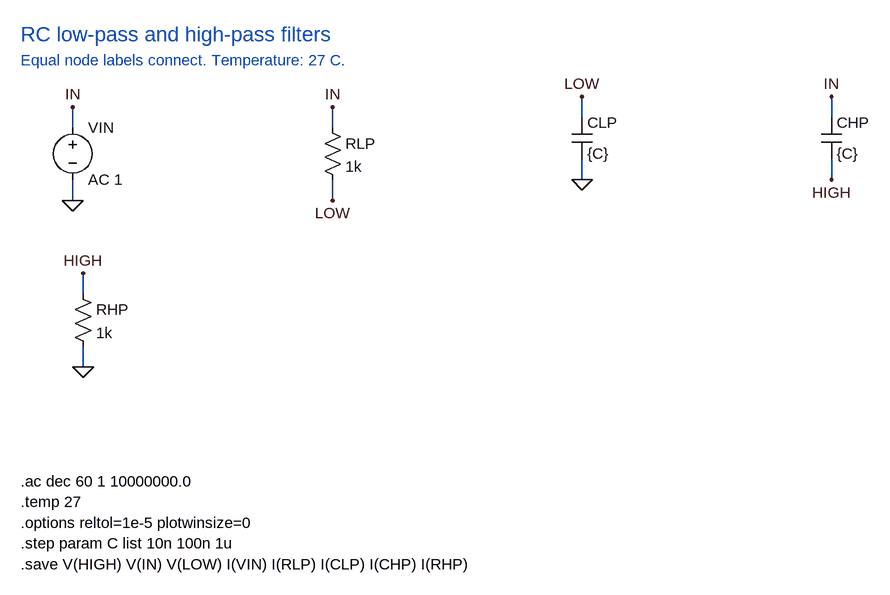
[diagram p0: schematic rc-filter-pair.asc]
rc-filter-pair.asc, the LTspice schematic file:
Version 4
SHEET 1 1740 1000
WIRE 144 176 144 144
WIRE 144 256 144 288
WIRE 544 176 544 144
WIRE 544 256 544 288
WIRE 928 160 928 128
WIRE 928 224 928 256
WIRE 1312 160 1312 128
WIRE 1312 224 1312 256
WIRE 160 432 160 400
WIRE 160 512 160 544
FLAG 144 144 IN
FLAG 144 288 0
FLAG 544 144 IN
FLAG 544 288 LOW
FLAG 928 128 LOW
FLAG 928 256 0
FLAG 1312 128 IN
FLAG 1312 256 HIGH
FLAG 160 400 HIGH
FLAG 160 544 0
SYMBOL voltage 144 160 R0
SYMATTR InstName VIN
SYMATTR Value AC 1
SYMBOL res 528 160 R0
SYMATTR InstName RLP
SYMATTR Value 1k
SYMBOL cap 912 160 R0
SYMATTR InstName CLP
SYMATTR Value {C}
SYMBOL cap 1296 160 R0
SYMATTR InstName CHP
SYMATTR Value {C}
SYMBOL res 144 416 R0
SYMATTR InstName RHP
SYMATTR Value 1k
TEXT 64 32 Left 3 ;RC low-pass and high-pass filters
TEXT 64 72 Left 2 ;Equal node labels connect. Temperature: 27 C.
TEXT 64 720 Left 2 !.ac dec 60 1 10000000.0
TEXT 64 752 Left 2 !.temp 27
TEXT 64 784 Left 2 !.options reltol=1e-5 plotwinsize=0
TEXT 64 816 Left 2 !.step param C list 10n 100n 1u
TEXT 64 848 Left 2 !.save V(HIGH) V(IN) V(LOW) I(VIN) I(RLP) I(CLP) I(CHP) I(RHP)

The netlist it stands for:
* rc-filter-pair.asc
VIN IN 0 AC 1
RLP IN LOW 1k
CLP LOW 0 {C}
CHP IN HIGH {C}
RHP HIGH 0 1k
* RC low-pass and high-pass filters
* Equal node labels connect. Temperature: 27 C.
.ac dec 60 1 10000000.0
.temp 27
.options reltol=1e-5 plotwinsize=0
.step param C list 10n 100n 1u
.save V(HIGH) V(IN) V(LOW) I(VIN) I(RLP) I(CLP) I(CHP) I(RHP)
.backanno
.end